# Altium schematic sheet mos双驱.SchDoc
size A4
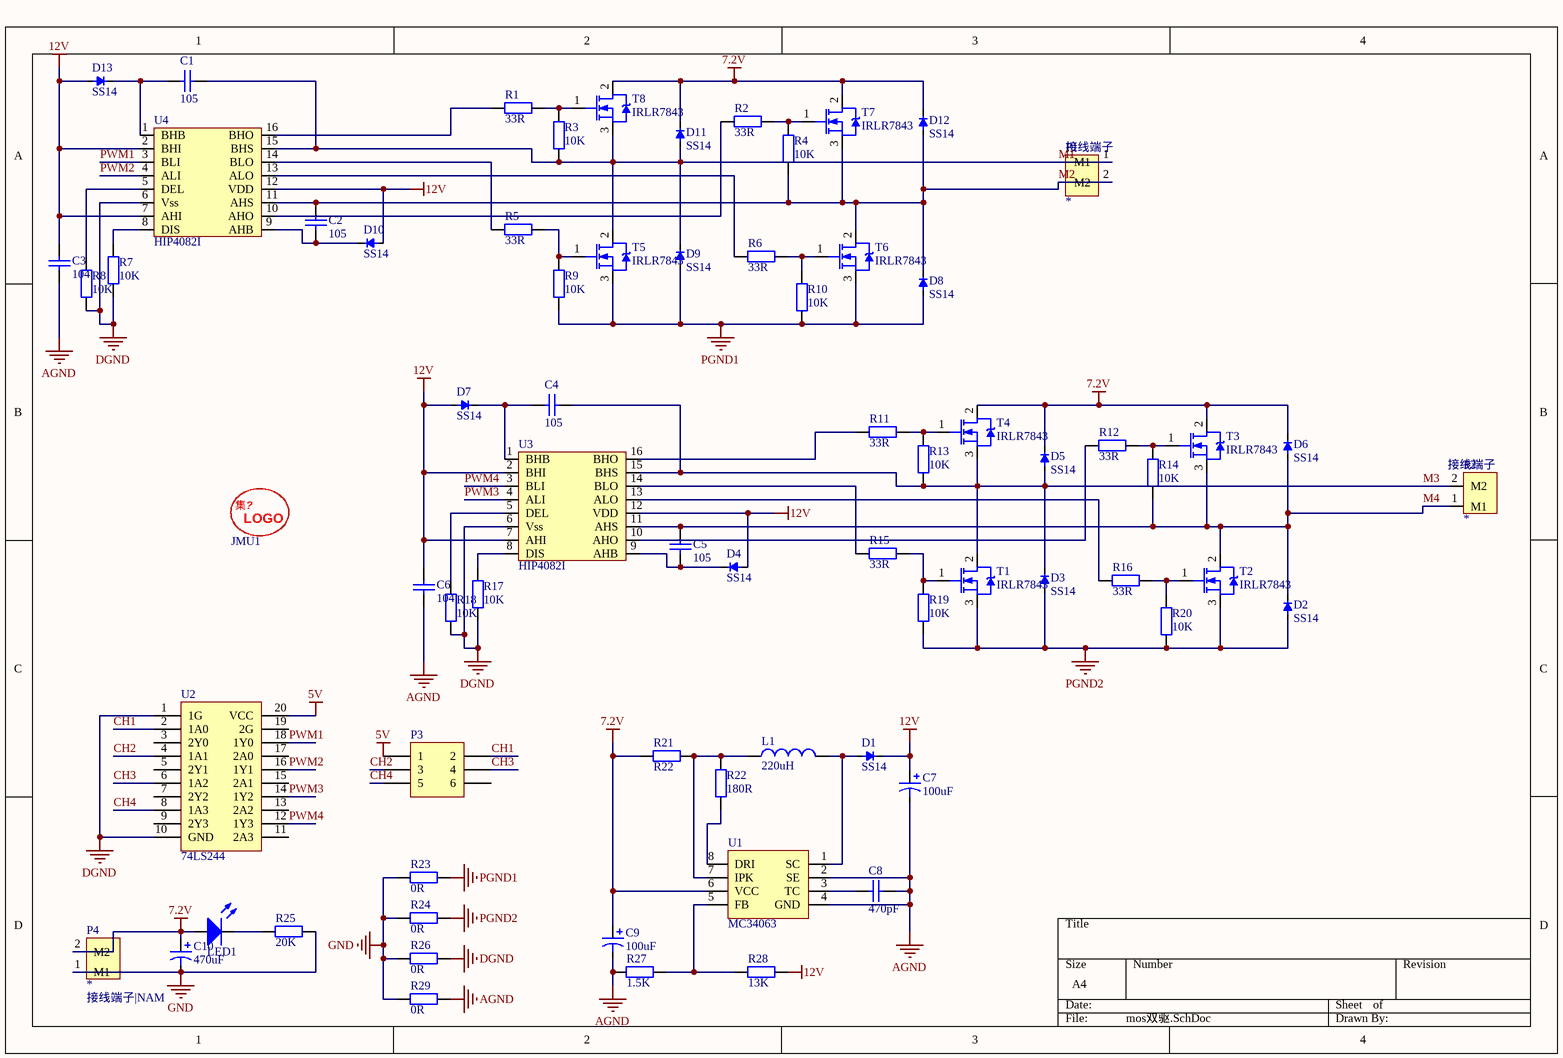
[diagram p0: mos双驱.SchDoc]

## Parts
C1  105  [0805]
C2  105  [0805]
C3  104  [0805]
C4  105  [0805]
C5  105  [0805]
C6  104  [0805]
C7  100uF  [ED6.3]
C8  470pF  [0805]
C9  100uF  [Pol Cap(220uF)]
C10  470uF  [ED8]
D1  SS14  [二极管]
D2  SS14  [二极管]
D3  SS14  [二极管]
D4  SS14  [二极管]
D5  SS14  [二极管]
D6  SS14  [二极管]
D7  SS14  [二极管]
D8  SS14  [二极管]
D9  SS14  [二极管]
D10  SS14  [二极管]
D11  SS14  [二极管]
D12  SS14  [二极管]
D13  SS14  [二极管]
JMU1  JMU  [JMU_logo（1）]  (value not drawn)
L1  220uH  [电感（220uh）]
LED1  LED  [LED(0805)]  (value not drawn)
P1  *  [接线端子]
P2  *  [接线端子]
P3  Header 3X2  [HDR2X3]  (value not drawn)
P4  *  [接线端子]
R1  33R  [0603]
R2  33R  [0603]
R3  10K  [0603]
R4  10K  [0603]
R5  33R  [0603]
R6  33R  [0603]
R7  10K  [0603]
R8  10K  [0603]
R9  10K  [0603]
R10  10K  [0603]
R11  33R  [0603]
R12  33R  [0603]
R13  10K  [0603]
R14  10K  [0603]
R15  33R  [0603]
R16  33R  [0603]
R17  10K  [0603]
R18  10K  [0603]
R19  10K  [0603]
R20  10K  [0603]
R21  R22  [0805]
R22  180R  [0805]
R23  0R  [0805]
R24  0R  [0805]
R25  20K  [0805]
R26  0R  [0805]
R27  1.5K  [0805]
R28  13K  [0805]
R29  0R  [0805]
T1  IRLR7843  [IRLR7843(MOS)]
T2  IRLR7843  [IRLR7843(MOS)]
T3  IRLR7843  [IRLR7843(MOS)]
T4  IRLR7843  [IRLR7843(MOS)]
T5  IRLR7843  [IRLR7843(MOS)]
T6  IRLR7843  [IRLR7843(MOS)]
T7  IRLR7843  [IRLR7843(MOS)]
T8  IRLR7843  [IRLR7843(MOS)]
U1  MC34063  [MA34063]
U2  74LS244  [74LS244D]
U3  HIP4082I  [HIP4082I]
U4  HIP4082I  [HIP4082I]

## Nets
5V: P3.1 U2.20(VCC)
7.2V: C9.1 C10.1 D5.2(-) D6.2(-) D11.2(-) D12.2(-) LED1.1(A) P4.2(M2) R21.2 T3.2(D) T4.2(D) T7.2(D) T8.2(D) U1.6(VCC)
12V: C3.2 C6.2 C7.1 D1.2(-) D4.1(+) D7.1(+) D10.1(+) D13.1(+) R28.2 U3.2(BHI) U3.7(AHI) U3.12(VDD) U4.2(BHI) U4.7(AHI) U4.12(VDD)
AGND: C3.1 C6.1 C7.2 C8.1 C9.2 R27.1 R29.2 U1.2(SE) U1.4(GND)
DGND: R7.1 R8.1 R17.1 R18.1 R26.2 U2.1(1G) U2.10(GND) U3.6(Vss) U4.6(Vss)
GND: C10.2 P4.1(M1) R23.1 R24.1 R25.2 R26.1 R29.1
PGND1: D8.1(+) D9.1(+) R9.1 R10.1 R23.2 T5.3(S) T6.3(S)
PGND2: D2.1(+) D3.1(+) R19.1 R20.1 R24.2 T1.3(S) T2.3(S)
CH1: P3.2 U2.2(1A0)
CH2: P3.3 U2.4(1A1)
CH3: P3.4 U2.6(1A2)
CH4: P3.5 U2.8(1A3)
M1: C1.2 D9.2(-) D11.1(+) P1.1(M1) R3.1 T5.2(D) T8.3(S) U4.15(BHS)
M2: C2.2 D8.2(-) D12.1(+) P1.2(M2) R4.1 T6.2(D) T7.3(S) U4.11(AHS)
M3: C4.2 D3.2(-) D5.1(+) P2.2(M2) R13.1 T1.2(D) T4.3(S) U3.15(BHS)
M4: C5.2 D2.2(-) D6.1(+) P2.1(M1) R14.1 T2.2(D) T3.3(S) U3.11(AHS)
PWM1: U2.18(1Y0) U4.3(BLI)
PWM2: U2.16(1Y1) U4.4(ALI)
PWM3: U2.14(1Y2) U3.4(ALI)
PWM4: U2.12(1Y3) U3.3(BLI)
NetC1_1: C1.1 D13.2(-) U4.1(BHB)
NetC2_1: C2.1 D10.2(-) U4.9(AHB)
NetC4_1: C4.1 D7.2(-) U3.1(BHB)
NetC5_1: C5.1 D4.2(-) U3.9(AHB)
NetC8_2: C8.2 U1.3(TC)
NetD1_1: D1.1(+) L1.2 U1.1(SC)
NetL1_1: L1.1 R21.1 R22.2 U1.7(IPK)
NetLED1_2: LED1.2(K) R25.1
NetR1_1: R1.1 R3.2 T8.1(G)
NetR1_2: R1.2 U4.16(BHO)
NetR2_1: R2.1 R4.2 T7.1(G)
NetR2_2: R2.2 U4.10(AHO)
NetR5_1: R5.1 R9.2 T5.1(G)
NetR5_2: R5.2 U4.14(BLO)
NetR6_1: R6.1 R10.2 T6.1(G)
NetR6_2: R6.2 U4.13(ALO)
NetR7_2: R7.2 U4.8(DIS)
NetR8_2: R8.2 U4.5(DEL)
NetR11_1: R11.1 R13.2 T4.1(G)
NetR11_2: R11.2 U3.16(BHO)
NetR12_1: R12.1 R14.2 T3.1(G)
NetR12_2: R12.2 U3.10(AHO)
NetR15_1: R15.1 R19.2 T1.1(G)
NetR15_2: R15.2 U3.14(BLO)
NetR16_1: R16.1 R20.2 T2.1(G)
NetR16_2: R16.2 U3.13(ALO)
NetR17_2: R17.2 U3.8(DIS)
NetR18_2: R18.2 U3.5(DEL)
NetR22_1: R22.1 U1.8(DRI)
NetR27_2: R27.2 R28.1 U1.5(FB)

Not connected (* = marked no-connect by the designer): P3 6; U2 3(2Y0) 5(2Y1) 7(2Y2) 9(2Y3) 11(2A3) 13(2A2) 15(2A1) 17(2A0) 19(2G)

## Notes on the sheet
- (in symbol JMU-LOGO) 集?; LOGO
- (in symbol 接线端子) 接线端子|NAM

## Library data of the parts
C1-C6 C8 = Cap: 无极电容; Value: 10uF
C7 C9 = pol cap: 通用有极电容; value: 22uF
C10 = 固态贴片电容: ED8:470UF  ED6.3:100UF
D1-D13 = IN5819
JMU1 = JMU-LOGO
L1 = 电感 220uh: 7*7*4; Value: 220uH
LED1 = LED: 发光二极管
P1 P2 P4 = 接线端子
P3 = Header 3X2: Header, 3-Pin, Dual row; LatestRevisionDate: 17-Jul-2002; LatestRevisionNote: Re-released for DXP Platform.; Publisher: Altium Limited
R1 R2 R5 R6 R11 R12 R15 R16 R21-R29 = Res: 通用电阻; Value: 10K
R3 R4 R7-R10 R13 R14 R17-R20 = Res: 通用电阻; Value: 10K
T1-T8 = N_MOS(I